# EAGLE design LowduinoPTH_v2 (EAGLE 7.2.0)
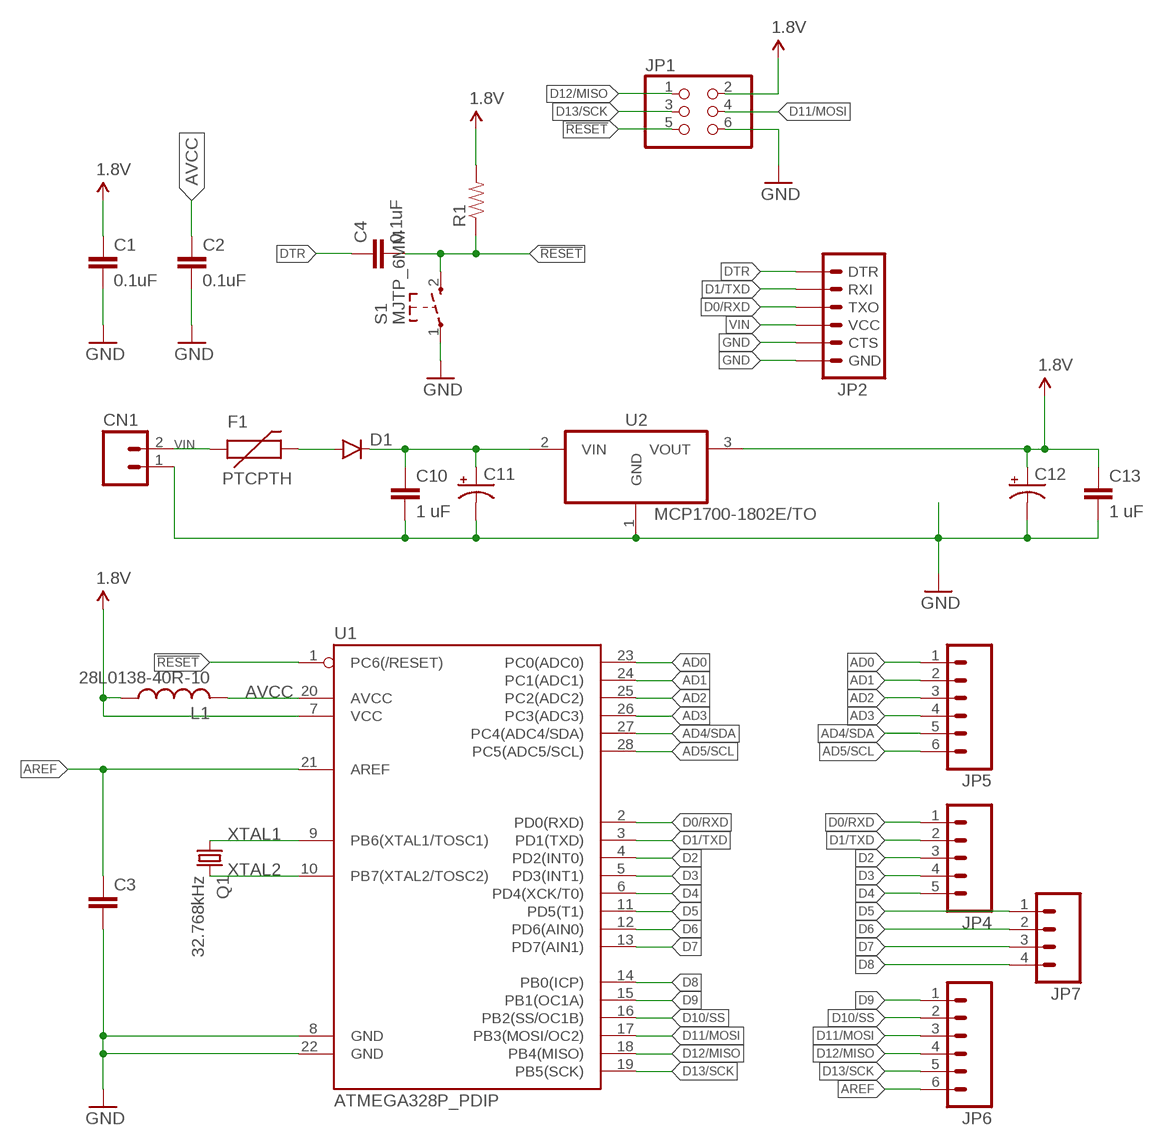
[diagram p0: schematic, sheet 1]

## Parts
C1  0.1uF  CAPPTH  [CAP-PTH-SMALL]
C2  0.1uF  CAPPTH1  [CAP-PTH-5MM]
C3  CAPPTH  [CAP-PTH-SMALL]
C4  0.1uF  CAPPTH  [CAP-PTH-SMALL]
C10  1 uF  CAPPTH  [CAP-PTH-SMALL]
C11  CPOL-USE2.5-6  [E2,5-6]
C12  CPOL-USE2.5-6  [E2,5-6]
C13  1 uF  CAPPTH  [CAP-PTH-SMALL]
CN1  M02JST-PTH-VERT  [JST-2-PTH-VERT]
D1  DIODEPTH  [DIODE-1N4001]
F1  PTCPTH  [PTC]
JP1  PINHD-2X3  [2X03]
JP2  ARDUINO_SERIAL_PROGRAMPTH  [1X06]
JP4  M05NO_SILK  [1X05_NO_SILK]
JP5  M06NO_SILK_FEMALE_PTH  [1X06_NO_SILK]
JP6  M06NO_SILK_FEMALE_PTH  [1X06_NO_SILK]
JP7  M04NO_SILK_ALL_ROUND  [1X04_NO_SILK_ALL_ROUND]
L1  28L0138-40R-10  L-USLAL03  [LAL03]
Q1  32.768kHz  CRYSTALTC26V  [TC26V]
R1  RESISTORPTH-1/4W-VERT  [AXIAL-0.1]
S1  MJTP_6MM  [MJTP1243]
U1  ATMEGA328P_PDIP  [DIL28-3]
U2  MCP1700-1802E/TO  [MICROCHIP_TO]

## Nets
1.8V: C1.1 C12.+ C13.1 JP1.2 L1.1 R1.P$2 U1.7(VCC) U2.3(VOUT)
!RESET: C4.2 JP1.5 R1.P$1 S1.2 U1.1(PC6(/RESET))
AD0: JP5.1 U1.23(PC0(ADC0))
AD1: JP5.2 U1.24(PC1(ADC1))
AD2: JP5.3 U1.25(PC2(ADC2))
AD3: JP5.4 U1.26(PC3(ADC3))
AD4/SDA: JP5.5 U1.27(PC4(ADC4/SDA))
AD5/SCL: JP5.6 U1.28(PC5(ADC5/SCL))
AREF: C3.1 JP6.6 U1.21(AREF)
AVCC: C2.1 L1.2 U1.20(AVCC)
D0/RXD: JP2.3(TXO) JP4.1 U1.2(PD0(RXD))
D1/TXD: JP2.2(RXI) JP4.2 U1.3(PD1(TXD))
D2: JP4.3 U1.4(PD2(INT0))
D3: JP4.4 U1.5(PD3(INT1))
D4: JP4.5 U1.6(PD4(XCK/T0))
D5: JP7.1 U1.11(PD5(T1))
D6: JP7.2 U1.12(PD6(AIN0))
D7: JP7.3 U1.13(PD7(AIN1))
D8: JP7.4 U1.14(PB0(ICP))
D9: JP6.1 U1.15(PB1(OC1A))
D10/SS: JP6.2 U1.16(PB2(SS/OC1B))
D11/MOSI: JP1.4 JP6.3 U1.17(PB3(MOSI/OC2))
D12/MISO: JP1.1 JP6.4 U1.18(PB4(MISO))
D13/SCK: JP1.3 JP6.5 U1.19(PB5(SCK))
DTR: C4.1 JP2.1(DTR)
GND: C1.2 C2.2 C3.2 C10.2 C11.- C12.- C13.2 CN1.1 JP1.6 JP2.5(CTS) JP2.6(GND) S1.1 U1.8(GND) U1.22(GND) U2.1(GND)
N$3: D1.A F1.P$2
N$7: C10.1 C11.+ D1.C U2.2(VIN)
VIN: CN1.2 F1.P$1 JP2.4(VCC)
XTAL1: Q1.1 U1.9(PB6(XTAL1/TOSC1))
XTAL2: Q1.2 U1.10(PB7(XTAL2/TOSC2))

## Library data of the parts
C1 C3 C4 C10 C13 = SparkFun-Capacitors:CAP: Capacitor Standard 0603 ceramic capacitor, and 0.1" leaded capacitor.
C2 = SparkFun-Passives:CAP: Capacitor Standard 0603 ceramic capacitor, and 0.1" leaded capacitor.
C11 C12 = rcl:CPOL-US: POLARIZED CAPACITOR, American symbol
CN1 = SparkFun-Connectors:M02: Standard 2-pin 0.1" header. Use with - straight break away headers ( PRT-00116) - right angle break away headers (PRT-00553) - swiss pins (PRT-00743) - machine pins (PRT-00117) - female headers (PRT-00115) Molex polarized connector foot print use with: PRT-08233 with associated crimp pins and housings. 2.54_SCREWTERM for use with PRT-10571. 3.5mm Screw Terminal footprints for PRT-08084 5mm Screw Terminal footprints for use with PRT-08432
D1 = SparkFun-DiscreteSemi:DIODE: Diode These are standard reverse protection diodes and small signal diodes. SMA package can handle up to about 1A. SOD-323 can handle about 200mA. What the SOD-323 package when ordering, there are some mfgs out there that are 5-pin packages.
F1 = SparkFun-PowerIC:PTC: Resettable Fuse PTC Resettable Fuse. Spark Fun Electronics SKU : COM-08357
JP1 = pinhead:PINHD-2X3: PIN HEADER
JP2 = SparkFun-Connectors:ARDUINO_SERIAL_PROGRAM: FTDI connector footprints
JP4 = SparkFun-Connectors:M05: Header 5 Standard 5-pin 0.1" header. Use with straight break away headers (SKU : PRT-00116), right angle break away headers (PRT-00553), swiss pins (PRT-00743), machine pins (PRT-00117), and female headers (PRT-00115). Molex polarized connector foot print use with SKU : PRT-08230 with associated crimp pins and housings.
JP5 JP6 = SparkFun-Connectors:M06: Header 6 Standard 6-pin 0.1" header. Use with straight break away headers (SKU : PRT-00116), right angle break away headers (PRT-00553), swiss pins (PRT-00743), machine pins (PRT-00117), and female headers (PRT-00115). Molex polarized connector foot print use with SKU : PRT-08094 with associated crimp pins and housings. NOTES ON THE VARIANTS LOCK and LOCK_LONGPADS... This footprint was designed to help hold the alignment of a through-hole component (i.e. 6-pin header) while soldering it into place. You may notice that each hole has been shifted either up or down by 0.005 of an inch from it's more standard position (which is a perfectly straight line). This slight alteration caused the pins (the squares in the middle) to touch the edges of the holes. Because they are alternating, it causes a "brace" to hold the component in place. 0.005 has proven to be the perfect amount of "off-center" position when using our standard breakaway headers. Although looks a little odd when you look at the bare footprint, once you have a header in there, the alteration is very hard to notice. Also,if you push a header all the way into place, it is covered up entirely on the bottom side. This idea of altering the position of holes to aid alignment will be further integrated into the Sparkfun Library for other footprints. It can help hold any component with 3 or more connection pins.; PROD_ID: CONN-08437
JP7 = SparkFun-Connectors:M04: Header 4 Standard 4-pin 0.1" header. Use with straight break away headers (SKU : PRT-00116), right angle break away headers (PRT-00553), swiss pins (PRT-00743), machine pins (PRT-00117), and female headers (PRT-00115). Molex polarized connector foot print use with SKU : PRT-08231 with associated crimp pins and housings. 1MM SMD Version SKU: PRT-10208
L1 = rcl:L-US: INDUCTOR, American symbol
Q1 = adafruit:CRYSTAL: CRYSTAL; OC_FARNELL: unknown; OC_NEWARK: unknown
R1 = SparkFun-Resistors:RESISTOR: Resistor Basic schematic elements and footprints for 0603, 1206, and PTH resistors.
S1 = Lowduino:MJTP_6MM
U1 = SparkFun-DigitalIC:ATMEGA328P_PDIP: uC used in the Arduino 32kb flash, 1k EEPROM, 2k SRAM This is the through-hole version of this chip.
U2 = 1V8:MCP1700: Low Quiescent Current LDO 1.8V 200MA; MPN: MCP1700-1802E/TO; OC_FARNELL: 1331479; OC_NEWARK: 34M7413; PACKAGE: TO-92; SUPPLIER: Microchip

## Board
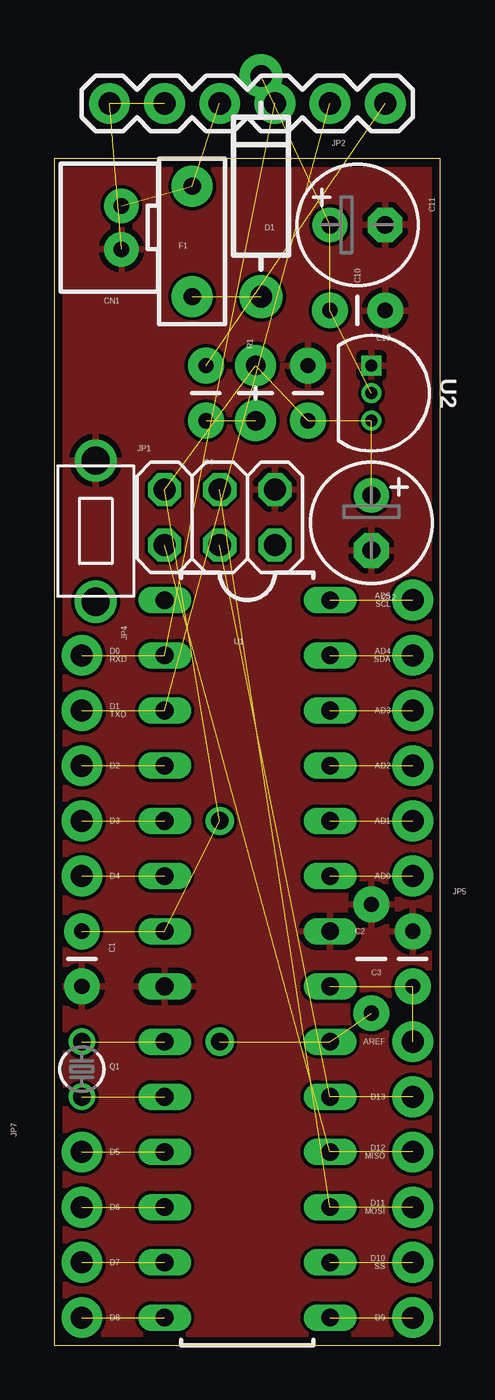
[diagram p1: board, top side]
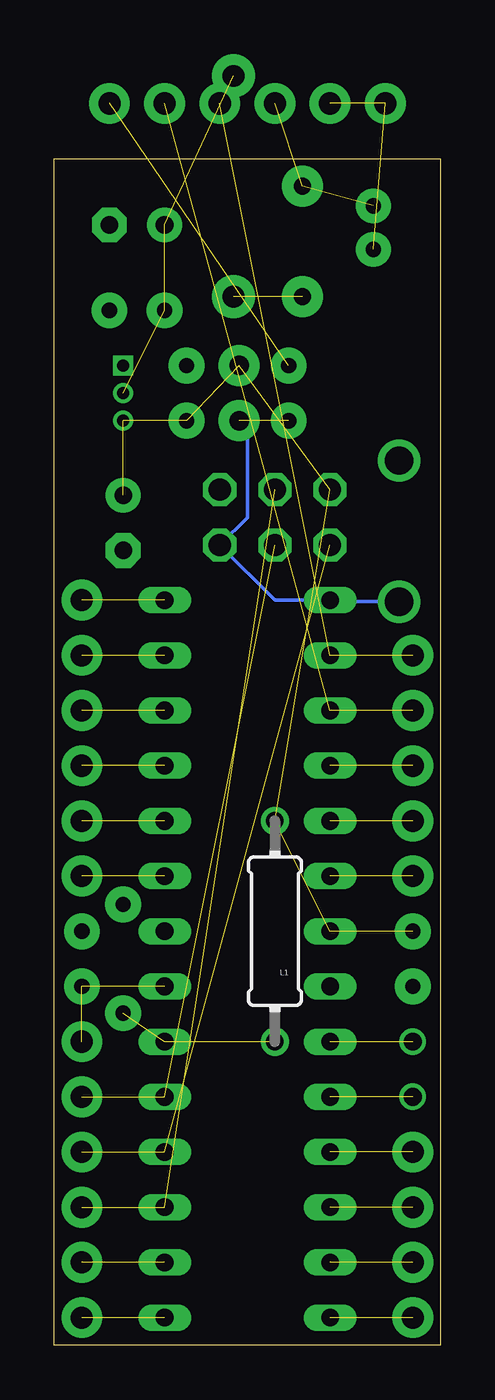
[diagram p2: board, bottom side, seen from below]

Size 17.78 x 54.61 mm. Coordinates in mm from the lower left corner, seen from the top.
Outline: 17.78,54.61 0,54.61 0,0 17.78,0 17.78,54.61
Copper layers (1*16): Top 0.0356mm / dielectric 1.5011mm / Bottom 0.0356mm
Design rules "oshpark-2layer": minimum track width 6mil, minimum drill 13mil, track to track 6mil, track to pad 6mil, pad to pad 6mil, via to via 6mil, smd to smd 6mil, copper to edge 15mil, drill to drill 6mil, minimum pad ring 7mil, minimum via ring 7mil, stop-mask expansion 4mil, vias tented up to drill 0mil, thermal gap 10mil

### Footprints (pad centres in the part's own frame; a part is rotated, then mirrored left to right if it is on the bottom)
CAP-PTH-SMALL = drill 0.7 pad 1.651: 1 0,0; 2 2.54,0
CAP-PTH-5MM = drill 0.7 pad 1.651: 1 -2.5,0; 2 2.5,0
E2,5-6 = drill 0.813 pad 1.6: + -1.27,0 | drill 0.813 pad 1.6 octagon: - 1.27,0
JST-2-PTH-VERT = drill 0.7 pad 1.6: 1 -1,-0.55; 2 1,-0.55
DIODE-1N4001 = drill 1 pad 1.981: A -5.08,0; C 5.08,0
PTC = drill 0.8 pad 1.88: P$1 -2.54,0; P$2 2.54,0
2X03 = drill 1.016 octagon: 1 -2.54,-1.27; 2 -2.54,1.27; 3 0,-1.27; 4 0,1.27; 5 2.54,-1.27; 6 2.54,1.27
1X06 = drill 1.016 pad 1.88: 1 0,0; 2 2.54,0; 3 5.08,0; 4 7.62,0; 5 10.16,0; 6 12.7,0
1X05_NO_SILK = drill 1.016 pad 1.88: 1 0,0; 2 2.54,0; 3 5.08,0; 4 7.62,0; 5 10.16,0
1X06_NO_SILK = drill 1.016 pad 1.88: 1 0,0; 2 2.54,0; 3 5.08,0; 4 7.62,0; 5 10.16,0; 6 12.7,0
1X04_NO_SILK_ALL_ROUND = drill 1.016 pad 1.88: 1 0,0; 2 2.54,0; 3 5.08,0; 4 7.62,0
LAL03 = drill 0.8 pad 1.3: 1 -5.08,0; 2 5.08,0
TC26V = drill 0.813: 1 -1.27,0; 2 1.27,0
AXIAL-0.1 = drill 0.9 pad 1.88: P$1 0,0; P$2 2.54,0
MJTP1243 = drill 1.3: 1 -3.25,0; 2 3.25,0
DIL28-3 = drill 0.813 long: 1 -16.51,-3.81; 2 -13.97,-3.81; 3 -11.43,-3.81; 4 -8.89,-3.81; 5 -6.35,-3.81; 6 -3.81,-3.81; 7 -1.27,-3.81; 8 1.27,-3.81; 9 3.81,-3.81; 10 6.35,-3.81; 11 8.89,-3.81; 12 11.43,-3.81; 13 13.97,-3.81; 14 16.51,-3.81; 15 16.51,3.81; 16 13.97,3.81; 17 11.43,3.81; 18 8.89,3.81; 19 6.35,3.81; 20 3.81,3.81; 21 1.27,3.81; 22 -1.27,3.81; 23 -3.81,3.81; 24 -6.35,3.81; 25 -8.89,3.81; 26 -11.43,3.81; 27 -13.97,3.81; 28 -16.51,3.81
MICROCHIP_TO = drill 0.559 square: 1 -1.27,0 | drill 0.559: 2 0,0; 3 1.27,0

### Placement (x,y rotation side)
C1  1.27,19.05 270 top
C2  14.61,17.78 90 top
C3  16.51,16.51 90 top
C4  6.99,45.09 270 top
C10  12.7,47.62 0 top
C11  13.97,51.56 0 top
C12  14.61,37.85 270 top
C13  11.68,42.55 90 top
CN1  2.54,51.44 90 top
D1  9.53,53.34 90 top
F1  6.35,50.8 270 top
JP1  7.62,38.1 0 top
JP2  15.24,57.15 180 top
JP4  1.27,31.75 270 top
JP5  16.51,21.59 90 top
JP6  16.51,1.27 90 top
JP7  1.27,8.89 270 top
L1  7.62,19.05 270 bottom
Q1  1.27,12.7 270 top
R1  9.27,42.55 90 top
S1  1.91,37.47 270 top
U1  8.89,17.78 270 top
U2  14.61,43.81 270 top

### Tracks (layer width: path | path; a pad name or v marks a point on that pad's centre or on a via)
1.8V  (7 unrouted)
!RESET  (1 unrouted)
  Bottom 0.152: R1.P$1 8.89,42.16 8.89,38.1 JP1.5 7.62,34.29 U1.1 5,34.22 S1.2
AD0  (1 unrouted)
AD1  (1 unrouted)
AD2  (1 unrouted)
AD3  (1 unrouted)
AD4/SDA  (1 unrouted)
AD5/SCL  (1 unrouted)
AREF  (2 unrouted)
AVCC  (2 unrouted)
D0/RXD  (2 unrouted)
D1/TXD  (2 unrouted)
D2  (1 unrouted)
D3  (1 unrouted)
D4  (1 unrouted)
D5  (1 unrouted)
D6  (1 unrouted)
D7  (1 unrouted)
D8  (1 unrouted)
D9  (1 unrouted)
D10/SS  (1 unrouted)
D11/MOSI  (2 unrouted)
D12/MISO  (2 unrouted)
D13/SCK  (2 unrouted)
DTR  (1 unrouted)
GND  (2 unrouted)
  pour Top: 17.78,54.61 0,54.61 0,0 17.78,0
N$3  (1 unrouted)
N$7  (3 unrouted)
VIN  (2 unrouted)
XTAL1  (1 unrouted)
XTAL2  (1 unrouted)

### Text on the board
tNames: AD5 / SCL | D0 / RXD | AD4 / SDA | D1 / TXD | AD3 | D2 | AD2 | D3 | AD1 | D4 | AD0 | AREF | GND | D13 | D5 | D12 / MISO | D6 | D11 / MOSI | D7 | D10 / SS | D8 | D9